# EAGLE design Julia ABL Board (EAGLE 9.5.2)
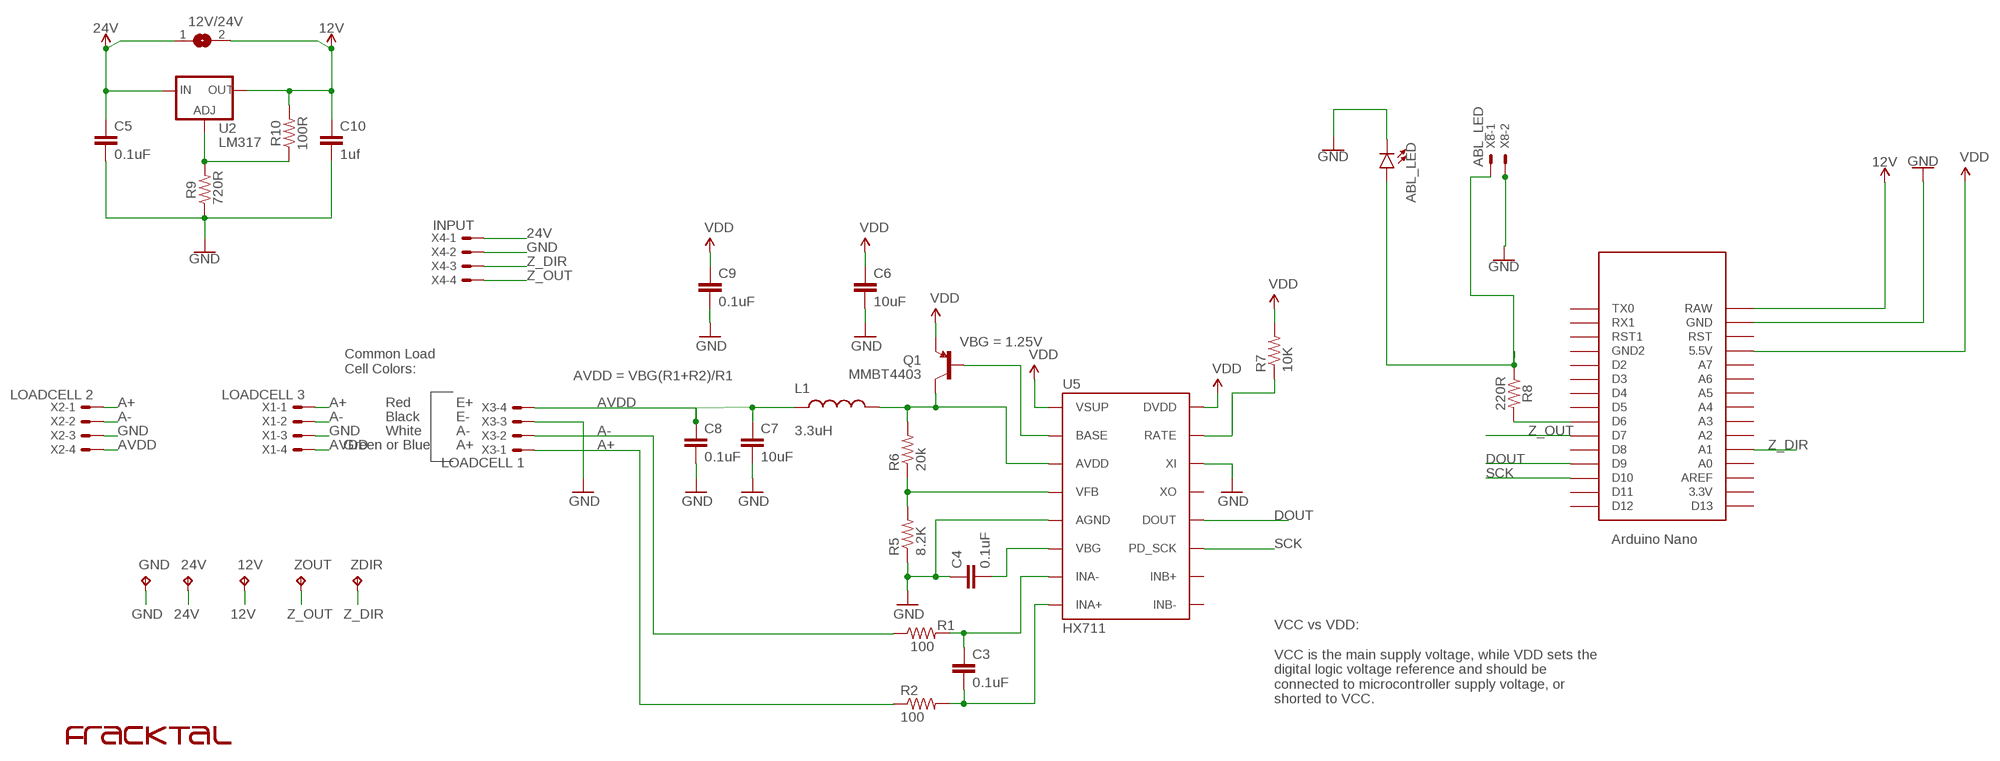
[diagram p0: schematic, sheet 1]

## Parts
12V  TPB2,54  [B2,54]
12V/24V  SJ  [SJ]
24V  TPB2,54  [B2,54]
ABL_LED  LED-3MM-NO_SILK  [LED_3MM-NS]
C3  0.1uF  0.1UF-25V-5%(0603)  [0603-CAP]
C4  0.1uF  0.1UF-25V-5%(0603)  [0603-CAP]
C5  0.1uF  9.0PF-0603-50V-10%  [0603]
C6  10uF  10UF50V20%(1210)  [1210]
C7  10uF  10UF50V20%(1210)  [1210]
C8  0.1uF  0.1UF-25V-5%(0603)  [0603-CAP]
C9  0.1uF  0.1UF-25V-5%(0603)  [0603-CAP]
C10  1uf  9.0PF-0603-50V-10%  [0603]
GND  TPB2,54  [B2,54]
L1  3.3uH  INDUCTOR0805-IND  [0805]
Q1  MMBT4403  TRANSISTOR_PNPMMBT4403  [SOT23-3]
R1  100  100OHM-1/10W-1%(0603)  [0603-RES]
R2  100  100OHM-1/10W-1%(0603)  [0603-RES]
R5  8.2K  8.2KOHM-1/10W-5%(0603)  [0603-RES]
R6  20k  20KOHM1/10W1%(0603)  [0603-RES]
R7  10K  10KOHM-1/10W-1%(0603)0603  [0603-RES]
R8  220R  RESISTOR0603  [0603]
R9  720R  RESISTOR0603  [0603]
R10  100R  RESISTOR0603  [0603]
U2  LM317  V_REG_317SMD  [SOT223]
U5  HX711  HX711HX711  [SO16]
U$1  NANO  [NANO]
U$2  FRACKTALLOGO  [FRACKTALLOGO]
X1  LOADCELL 3  JST-XH-04-PIN-LONG-PAD  [JST-XH-04-PACKAGE-LONG-PAD]
X2  LOADCELL 2  JST-XH-04-PIN-LONG-PAD  [JST-XH-04-PACKAGE-LONG-PAD]
X3  LOADCELL 1  JST-XH-04-PIN-LONG-PAD  [JST-XH-04-PACKAGE-LONG-PAD]
X4  INPUT  JST-XH-04-PIN-LONG-PAD  [JST-XH-04-PACKAGE-LONG-PAD]
X8  ABL_LED  JST-XH-02-PIN-LONG-PAD  [JST-XH-02-PACKAGE-LONG-PAD]
ZDIR  TPB2,54  [B2,54]
ZOUT  TPB2,54  [B2,54]

## Nets
12V: 12V.TP 12V/24V.2 C10.1 R10.2 U2.2(OUT) U$1.RAW
24V: 12V/24V.1 24V.TP C5.1 U2.3(IN) X4.1
A+: R2.1 X1.1 X2.1 X3.1
A-: R1.1 X1.2 X2.2 X3.2
ADJ1: R9.2 R10.1 U2.1(ADJ)
AVDD: C7.1 C8.1 L1.1 X1.4 X2.4 X3.4
DOUT: U5.12(DOUT) U$1.D9
GND: ABL_LED.K(C) C4.1 C5.2 C6.2 C7.2 C8.2 C9.2 C10.2 GND.TP R5.1 R9.1 U5.5(AGND) U5.14(XI) U$1.GND X1.3 X2.3 X3.3 X4.2 X8.2
N$1: R8.2 U$1.D6
N$2: R7.1 U5.15(RATE)
N$3: C3.1 R1.2 U5.7(INA-)
N$4: Q1.1(B) U5.2(BASE)
N$5: L1.2 Q1.3(C) R6.2 U5.3(AVDD)
N$6: R5.2 R6.1 U5.4(VFB)
N$7: C4.2 U5.6(VBG)
N$8: C3.2 R2.2 U5.8(INA+)
N$14: ABL_LED.A R8.1 X8.1
SCK: U5.11(PD_SCK) U$1.D10
VDD: C6.1 C9.1 Q1.2(E) R7.2 U5.1(VSUP) U5.16(DVDD) U$1.5V(5.5V)
Z_DIR: U$1.A1 X4.3 ZDIR.TP
Z_OUT: U$1.D7 X4.4 ZOUT.TP
Unconnected: U5.9(INB-) U5.10(INB+) U5.13(XO) U$1.3.3V U$1.A0 U$1.A2 U$1.A3 U$1.A4 U$1.A5 U$1.A6 U$1.A7 U$1.AREF U$1.D2 U$1.D3 U$1.D4 U$1.D5 U$1.D8 U$1.D11 U$1.D12 U$1.D13 U$1.GND1(GND2) U$1.ICSP1 U$1.ICSP2 U$1.ICSP3 U$1.ICSP4 U$1.ICSP5 U$1.ICSP6 U$1.RST U$1.RST1 U$1.RX1 U$1.TX0

## Notes on the sheet
- VBG = 1.25V
- Common Load
  Cell Colors:
- AVDD = VBG(R1+R2)/R1
- Red | E+
- Black | E-
- White | A-
- Green or Blue | A+
- VCC vs VDD:
  
  VCC is the main supply voltage, while VDD sets the
  digital logic voltage reference and should be
  connected to microcontroller supply voltage, or
  shorted to VCC.

## Library data of the parts
12V 24V GND ZDIR ZOUT = testpad:TP: Test pad
12V/24V = jumper:SJ: SMD solder JUMPER
ABL_LED = SparkFun-LED:LED: LED (Generic) Standard schematic elements and footprints for 5mm, 3mm, 1206, and 0603 sized LEDs. Generic LEDs with no color specified.
C3 C4 C8 C9 = SparkFun-Capacitors:0.1UF-25V-5%(0603): CAP-08604; PROD_ID: CAP-08604
C5 C10 = SparkFun-Capacitors:9.0PF: 9.0pF ceramic capacitors A capacitor is a passive two-terminal electrical component used to store electrical energy temporarily in an electric field.; PROD_ID: CAP-09341; VALUE: 9.0pF
C6 C7 = SparkFun-Capacitors:10UF50V20%(1210): CAP-09824; PROD_ID: CAP-09824
L1 = SparkFun-Passives:INDUCTOR: Inductors Basic Inductor/Choke - 0603 and 1206. Footprints are not proven and vary greatly between part numbers. INDUCTOR POWER 3.3UH 4.0A SMD 0.197" L x 0.197" W x 0.177" H (5.00mm x 5.00mm x 4.50mm); PROD_ID: NDUC-13076
Q1 = SparkFun-DiscreteSemi:TRANSISTOR_PNP: Generic PNP BJT Double check pinouts against datasheets- not all devices are the same! MMBT3906 - 40V 200mA SOT-23 (TRANS-08052) MMBT4403 - 40V 600mA SOT-23 (TRANS-09245); PROD_ID: TRANS-09245
R1 R2 = SparkFun-Resistors:100OHM-1/10W-1%(0603): RES-07863; PROD_ID: RES-07863
R5 = SparkFun-Resistors:8.2KOHM-1/10W-5%(0603): RES-10646; PROD_ID: RES-10646
R6 = SparkFun-Resistors:20KOHM1/10W1%(0603): RES-09383; PROD_ID: RES-09383
R7 = SparkFun-Resistors:10KOHM-1/10W-1%(0603): RES-00824; PROD_ID: RES-00824
R8-R10 = SparkFun-Resistors:RESISTOR: Generic Resistor Package
U2 = SparkFun-IC-Power:V_REG_317: Voltage Regulator Standard LM317 adjustable voltage regulator. AOI (Adjust Output Input). Google 'LM317 Calculator' for easy to use app to get the two resistor values needed. 240/720 for 5V output. 240/390 for 3.3V output. Spark Fun Electronics SKU : COM-00527
U5 = Testing:HX711; PROD_ID: IC-12445
U$1 = Arduino-clone:NANO: Arduino Nano
U$2 = FracktalWorks_Eagle_Library:FRACKTALLOGO
X1-X4 = Rembrandt Electronics - JST XH Connectors v1-0:JST-XH-04-PIN: JST XH Connector 2 Pin Wire to board connector. Pitch: 2,54 mm, (0.100") Number of pins: 4 Created by Rembrandt Electronics www.rembrandtelectronics.com
X8 = Rembrandt Electronics - JST XH Connectors v1-0:JST-XH-02-PIN: JST XH Connector 2 Pin Wire to board connector. Pitch: 2,54 mm, (0.100") Number of pins: 2 Created by Rembrandt Electronics www.rembrandtelectronics.com

## Net classes
0 Test Points: width 0.406 mm

## Board
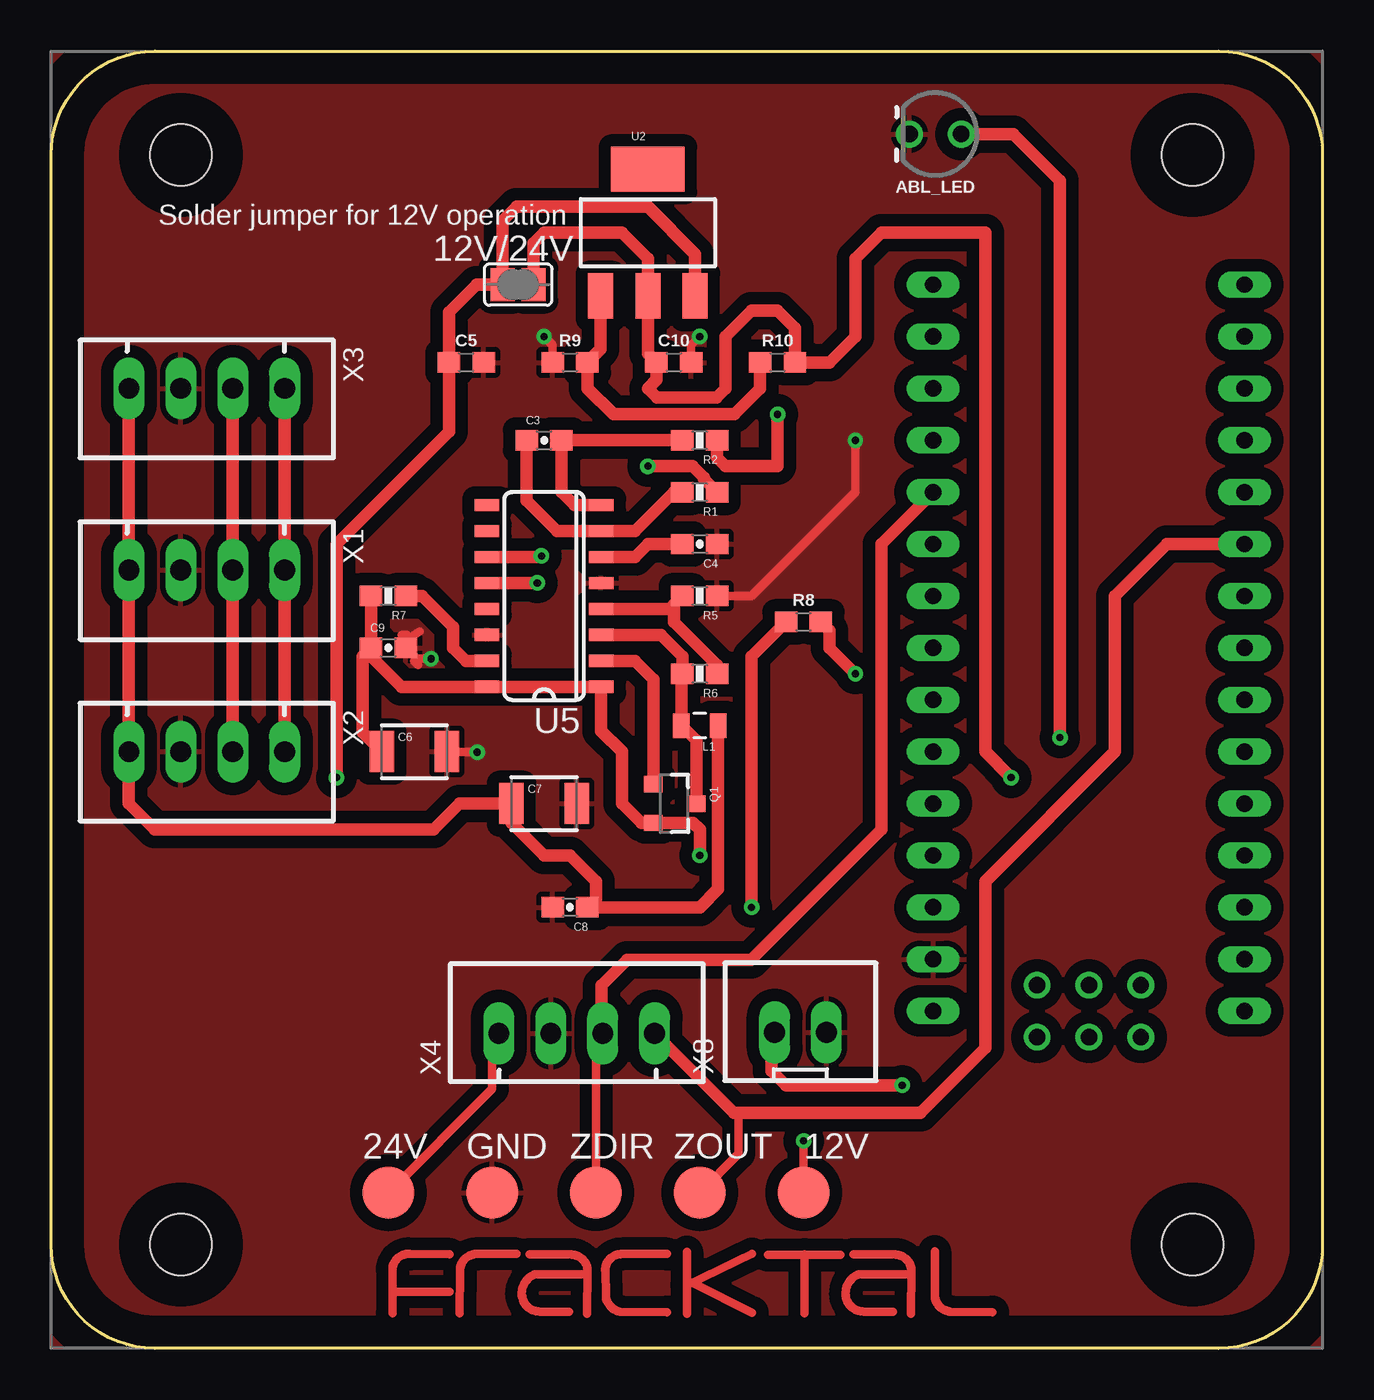
[diagram p1: board, top side]
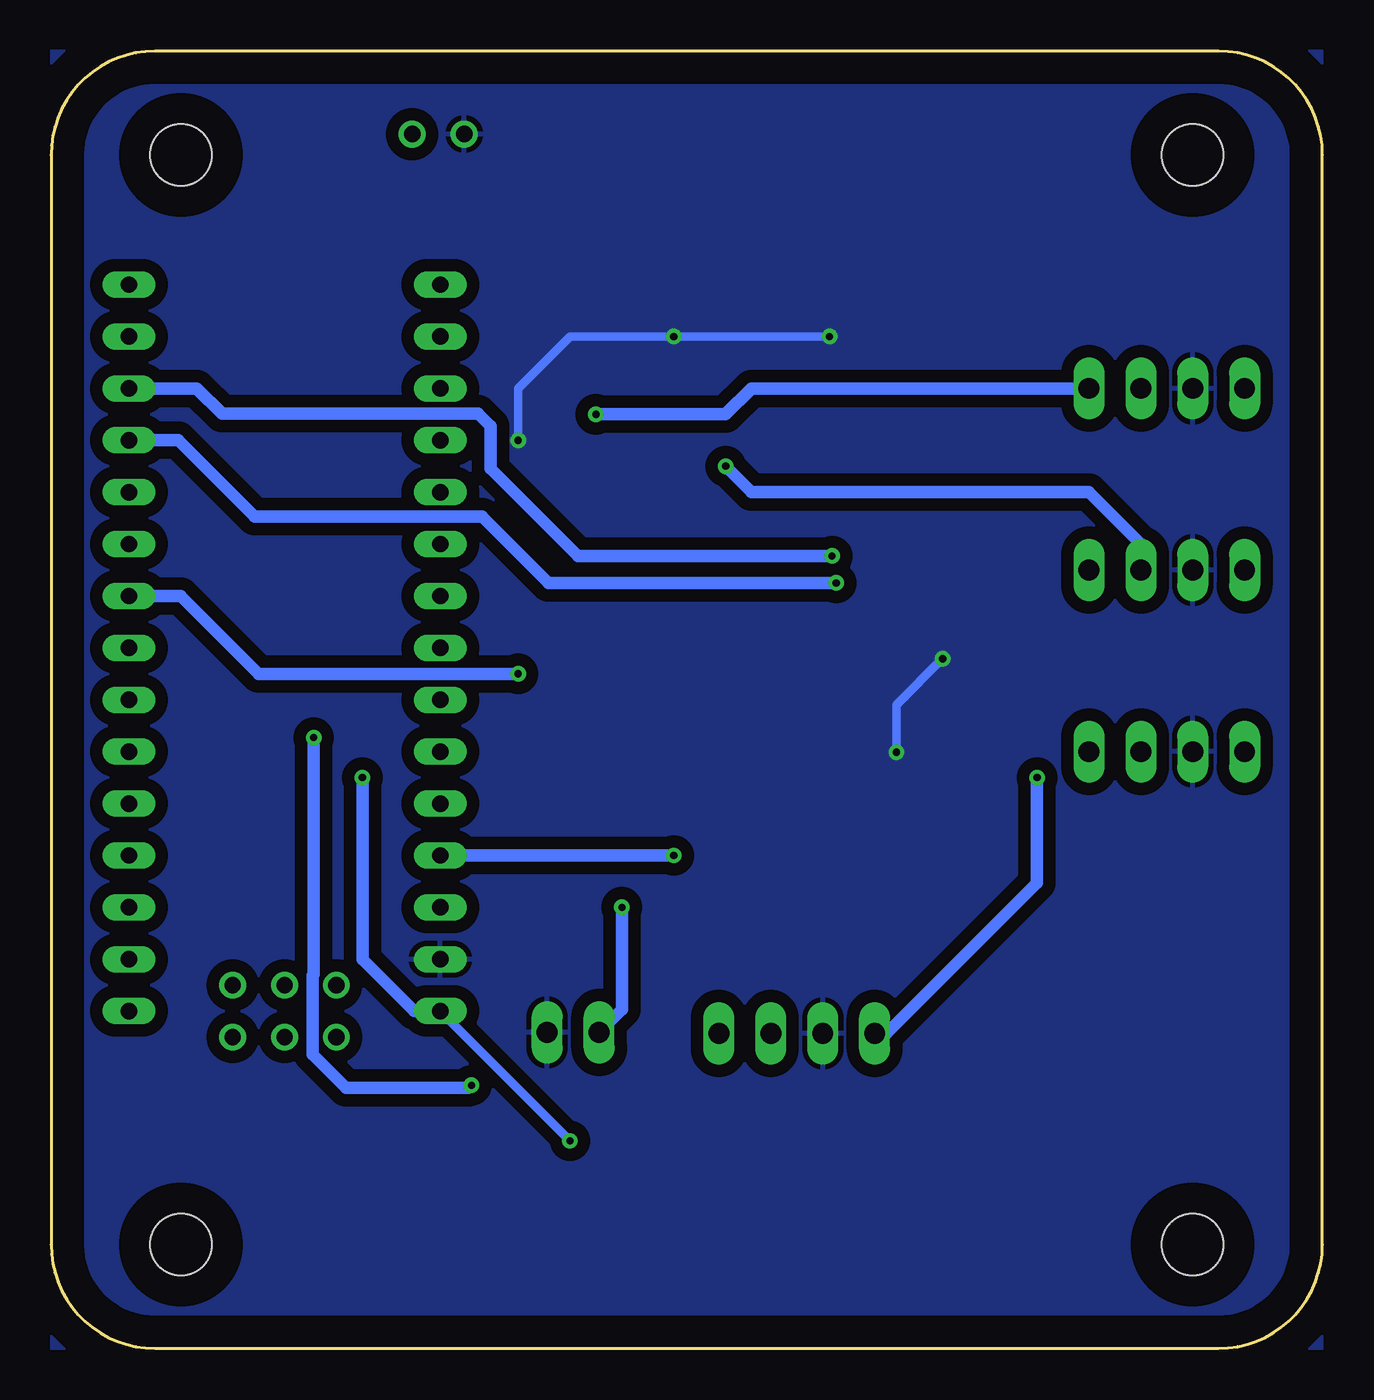
[diagram p2: board, bottom side, seen from below]

Size 62.23 x 63.5 mm. Coordinates in mm from the lower left corner, seen from the top.
Outline: 0,58.42 arc-90 5.08,63.5 57.15,63.5 arc-90 62.23,58.42 62.23,5.08 arc-90 57.15,0 5.08,0 arc-90 0,5.08 0,58.42
Copper layers (1*16): Top 0.035mm / dielectric 1.5mm / Bottom 0.035mm
Design rules "LionCircuits": minimum track width 8mil, minimum drill 0.35mm, track to track 8mil, track to pad 8mil, pad to pad 8mil, via to via 8mil, smd to smd 8mil, copper to edge 60mil, drill to drill 10mil, minimum pad ring 10mil, minimum via ring 8mil, stop-mask expansion 4mil, vias tented up to drill 0mil, thermal gap 10mil
Holes 3 mm at 6.35,58.42 55.88,58.42 55.88,5.08 6.35,5.08

### Footprints (pad centres in the part's own frame; a part is rotated, then mirrored left to right if it is on the bottom)
B2,54 = smd 2.54 x 2.54: TP 0,0
SJ = smd 1.168 x 1.6: 1 -0.762,0; 2 0.762,0
LED_3MM-NS = drill 0.813: A -1.27,0; K 1.27,0
0603-CAP = smd 1.1 x 1: 1 -0.85,0; 2 0.85,0
0603 = smd 1.1 x 1: 1 -0.85,0; 2 0.85,0
1210 = smd 1.2 x 2: 1 -1.6,0; 2 1.6,0
0805 = smd 0.8 x 1.2: 1 -0.9,0; 2 0.9,0
SOT23-3 = smd 0.8 x 0.9: 1 -0.95,-1; 2 0.95,-1; 3 0,1.1
0603-RES = smd 1.1 x 1: 1 -0.85,0; 2 0.85,0
SOT223 = smd 1.219 x 2.235: 1 -2.311,-3.099; 2 0,-3.099; 3 2.311,-3.099 | smd 3.6 x 2.2: 4 0,3.099
SO16 = smd 0.6 x 1.2: 1 -4.445,-2.8; 2 -3.175,-2.8; 3 -1.905,-2.8; 4 -0.635,-2.8; 5 0.635,-2.8; 6 1.905,-2.8; 7 3.175,-2.8; 8 4.445,-2.8; 9 4.445,2.8; 10 3.175,2.8; 11 1.905,2.8; 12 0.635,2.8; 13 -0.635,2.8; 14 -1.905,2.8; 15 -3.175,2.8; 16 -4.445,2.8
NANO = drill 0.8 long: 3.3V -10.16,24.13; 5V -10.16,-1.27; A0 -10.16,19.05; A1 -10.16,16.51; A2 -10.16,13.97; A3 -10.16,11.43; A4 -10.16,8.89; A5 -10.16,6.35; A6 -10.16,3.81; A7 -10.16,1.27; AREF -10.16,21.59; D2 5.08,1.27; D3 5.08,3.81; D4 5.08,6.35; D5 5.08,8.89; D6 5.08,11.43; D7 5.08,13.97; D8 5.08,16.51; D9 5.08,19.05; D10 5.08,21.59; D11 5.08,24.13; D12 5.08,26.67; D13 -10.16,26.67; GND -10.16,-6.35; GND1 5.08,-1.27; RAW -10.16,-8.89; RST -10.16,-3.81; RST1 5.08,-3.81; RX1 5.08,-6.35; TX0 5.08,-8.89 | drill 0.8: ICSP1 -5.08,-10.16; ICSP2 -5.08,-7.62; ICSP3 -2.54,-10.16; ICSP4 -2.54,-7.62; ICSP5 0,-10.16; ICSP6 0,-7.62
JST-XH-04-PACKAGE-LONG-PAD = drill 1.016 long: 1 -3.81,0; 2 -1.27,0; 3 1.27,0; 4 3.81,0
JST-XH-02-PACKAGE-LONG-PAD = drill 1.016 long: 1 -1.27,0; 2 1.27,0

### Placement (x,y rotation side)
12V  36.83,7.62 0 top
12V/24V  22.86,52.07 0 top
24V  16.51,7.62 0 top
ABL_LED  43.28,59.44 180 top
C3  24.13,44.45 0 top
C4  31.75,39.37 180 top
C5  20.32,48.26 0 top
C6  17.78,29.21 0 top
C7  24.13,26.67 0 top
C8  25.4,21.59 180 top
C9  16.51,34.29 0 top
C10  30.48,48.26 0 top
GND  21.59,7.62 0 top
L1  31.75,30.48 180 top
Q1  30.48,26.67 270 top
R1  31.75,41.91 180 top
R2  31.75,44.45 180 top
R5  31.75,36.83 180 top
R6  31.75,33.02 180 top
R7  16.51,36.83 180 top
R8  36.83,35.56 0 top
R9  25.4,48.26 0 top
R10  35.56,48.26 0 top
U2  29.21,54.61 0 top
U5  24.13,36.83 90 top
U$1  53.34,25.4 0 top
U$2  28.7,1.63 0 top
X1  7.62,38.1 180 top
X2  7.62,29.21 180 top
X3  7.62,46.99 180 top
X4  25.73,15.42 0 top
X8  36.68,15.47 0 top
ZDIR  26.67,7.62 0 top
ZOUT  31.75,7.62 0 top

### Tracks (layer width: path | path; a pad name or v marks a point on that pad's centre or on a via)
12V  (via drill 0.35)
  Top 0.406: 36.98,7.62 12V.TP v36.83,10.16 | 43.08,16.46 U$1.RAW
  Top 0.61: 12V/24V.2 23.62,54.1 24.13,54.61 27.94,54.61 29.21,53.34 U2.2 29.21,48.68 C10.1 29.63,47.41 29.21,46.99 29.67,46.53 32.56,46.53 33.02,46.99 33.02,49.53 34.29,50.8 35.56,50.8 36.41,49.95 R10.2 38.1,48.26 39.37,49.53 39.37,53.34 40.64,54.61 45.72,54.61 45.72,29.21 v46.99,27.94
  Bottom 0.406: U$1.RAW v36.83,10.16
  Bottom 0.61: v46.99,27.94 46.99,19.05 44.45,16.51 U$1.RAW
24V  (via drill 0.35)
  Top 0.406: 16.56,7.62 24V.TP 21.59,12.7 21.59,15.24 X4.1
  Top 0.61: U2.3 31.52,53.57 29.21,55.88 22.79,55.88 22.1,55.19 12V/24V.1 20.83,52.07 19.47,50.71 C5.1 19.47,44.87 13.97,39.37 v13.97,27.94
  Bottom 0.61: X4.1 21.34,15.42 13.97,22.78 v13.97,27.94
A+  (via drill 0.35)
  Top 0.61: X2.1 X1.1 X3.1 | R2.1 32.6,43.6 33.02,43.18 35.56,43.18 v35.56,45.72
  Bottom 0.61: X3.1 27.94,46.99 29.21,45.72 v35.56,45.72
A-  (via drill 0.35)
  Top 0.61: X3.2 X1.2 X2.2 | R1.1 31.96,42.55 31.96,42.62 31.4,43.18 v29.21,43.18
  Bottom 0.61: v29.21,43.18 27.94,41.91 11.43,41.91 8.89,39.37 X1.2
ADJ1
  Top 0.61: U2.1 26.9,48.91 R9.2 26.25,46.99 27.52,45.72 33.44,45.72 34.71,46.99 R10.1
AVDD
  Top 0.61: L1.1 32.65,22.49 31.75,21.59 C8.1 26.67,22.01 26.67,22.86 25.4,24.13 24.13,24.13 22.53,25.73 C7.1 19.99,26.67 18.72,25.4 5.08,25.4 3.81,26.67 X2.4 X1.4 X3.4
DOUT  (via drill 0.35)
  Top 0.61: U5.12 v23.8,37.46
  Bottom 0.61: v23.8,37.46 37.87,37.46 41.12,40.72 52.27,40.72 56.01,44.45 U$1.D9
GND  (via drill 0.35)
  Top 0.406: R9.1 24.55,49.11 v24.13,49.53 | v31.75,49.53 31.33,49.11 C10.2 | v39.37,44.45 39.37,41.91 34.29,36.83 R5.1 | 17.89,33.76 C9.2 17.14,34.29 17.44,34.21 | 17.89,33.76 v18.59,33.76 | v20.85,29.18 19.41,29.18 C6.2 | 17.95,33.46 17.78,33.66 17.89,33.76 | 17.14,34.92 17.44,34.92 | 17.78,34.92 18.04,35.1
  Bottom 0.406: v24.13,49.53 v31.75,49.53 36.83,49.53 39.37,46.99 v39.37,44.45 | v18.59,33.76 20.85,31.5 v20.85,29.18
  pour Top (isolate 0.61): 0,63.5 62.23,63.5 62.23,0 0,0
  pour Bottom (isolate 0.61): 0,63.5 62.23,63.5 62.23,0 0,0
N$1  (via drill 0.35)
  Top 0.61: R8.2 38.1,35.14 38.1,34.29 v39.37,33.02
  Bottom 0.61: U$1.D6 55.88,36.83 52.07,33.02 v39.37,33.02
N$2
  Top 0.61: U5.15 20.32,33.66 19.69,34.29 19.69,35.3 18.16,36.83 R7.1
N$3
  Top 0.61: C3.1 23.28,41.49 24.77,40 U5.7 28.58,40 30.48,41.91 R1.2
N$4
  Top 0.61: U5.2 28.58,33.66 29.48,32.75 Q1.1
N$5
  Top 0.61: U5.3 29.84,34.92 30.9,33.87 R6.2 30.85,32.97 L1.2 31.58,29.75 Q1.3
N$6
  Top 0.61: U5.4 30.27,36.19 R5.2 30.48,36.41 30.48,35.56 32.6,33.44 R6.1
N$7
  Top 0.61: U5.6 28.58,38.73 29.21,39.37 C4.2
N$8
  Top 0.61: R2.2 C3.2 24.98,41.91 25.62,41.27 U5.8
N$14  (via drill 0.35)
  Top 0.61: R8.1 34.29,33.87 v34.29,21.59 | ABL_LED.A 47.09,59.44 49.38,57.15 v49.38,29.9 | v41.66,12.88 35.97,12.88 35.26,13.59 35.26,15.32 X8.1
  Bottom 0.61: v34.29,21.59 34.29,16.59 X8.1 | v49.38,29.9 49.38,18.31 49.42,18.26 49.42,14.39 47.78,12.75 41.78,12.75 v41.66,12.88
SCK  (via drill 0.35)
  Top 0.61: U5.11 23.95,38.73 v24,38.79
  Bottom 0.61: v24,38.79 36.45,38.79 40.72,43.05 40.72,45.14 41.33,45.74 53.85,45.74 55.09,46.99 U$1.D10
VDD  (via drill 0.35)
  Top 0.61: R7.2 C9.1 | C9.1 15.24,33.87 15.24,30.15 C6.1 | v31.75,24.13 31.75,25.4 31.43,25.72 Q1.2 28.89,25.72 27.94,26.67 27.94,29.21 26.93,30.22 U5.1 U5.16 17.14,32.39 15.66,33.87 C9.1
  Bottom 0.61: v31.75,24.13 U$1.5V
Z_DIR
  Top 0.406: 26.92,7.62 ZDIR.TP 26.67,15.24 X4.3
  Top 0.61: U$1.A1 40.64,39.37 40.64,25.4 34.27,19.03 28.19,19.03 26.95,17.78 26.95,15.47 X4.3
Z_OUT
  Top 0.406: 31.5,7.62 ZOUT.TP 33.66,9.53 33.66,11.53
  Top 0.61: U$1.D7 54.61,39.37 52.07,36.83 52.07,29.21 45.72,22.86 45.72,14.71 42.55,11.53 33.66,11.53 33.43,11.53 X4.4

### Text on the board
tNames: Solder jumper for 12V operation
tValues: Julia ABL Board V1.1